# EAGLE design DualPower (EAGLE 9.6.2)
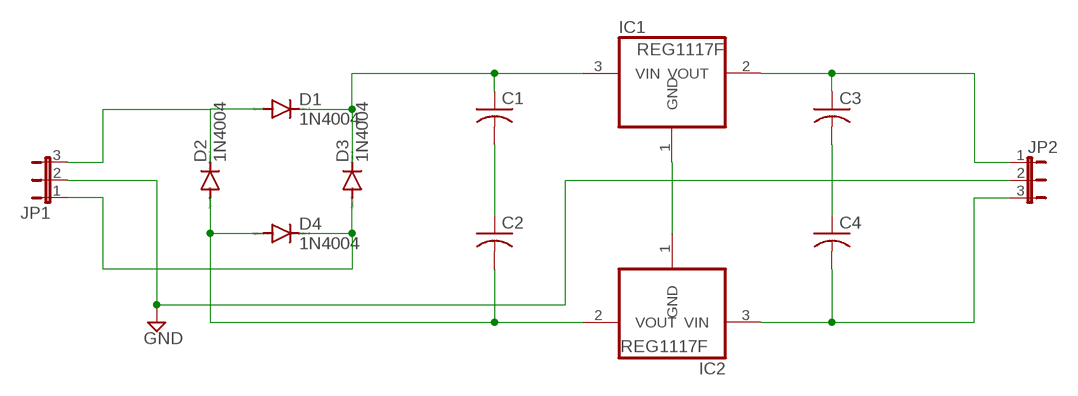
[diagram p0: schematic, sheet 1]

## Parts
C1  C-US025-040X050  [C025-040X050]
C2  C-US025-040X050  [C025-040X050]
C3  C-US025-040X050  [C025-040X050]
C4  C-US025-040X050  [C025-040X050]
D1  1N4004  [DO41-10]
D2  1N4004  [DO41-10]
D3  1N4004  [DO41-10]
D4  1N4004  [DO41-10]
IC1  REG1117F  [DD-3]
IC2  REG1117F  [DD-3]
JP1  JP2E  [JP2]
JP2  JP2E  [JP2]

## Nets
N$1: D1.A D2.C JP1.3
N$2: C2.2 D2.A D4.A IC2.2(VOUT)
N$3: D3.A D4.C JP1.1
N$4: C1.1 D1.C D3.C IC1.3(VIN)
N$5: C1.2 C2.1
N$6: IC1.1(GND) IC2.1(GND)
N$7: C3.2 C4.1
N$8: C3.1 IC1.2(VOUT) JP2.1
N$9: C4.2 IC2.3(VIN) JP2.3
N$11: JP1.2 JP2.2 ; supply symbol labelled GND

## Library data of the parts
C1-C4 = rcl:C-US: CAPACITOR, American symbol; SPICEPREFIX: C
D1-D4 = diode:1N4004: DIODE general purpose rectifier, 1 A
IC1 IC2 = burr-brown:REG1117: 800mA and 1A Low Dropout (LDO) Positive Regulator 1.8V, 2.5V, 2.85V, 3.3V, 5V, and Adj; MF: TEXAS INSTRUMENTS; MPN: REG1117FAKTTT; OC_FARNELL: 1296120; OC_NEWARK: 87H2562
JP1 JP2 = jumper:JP2E: JUMPER

## Board
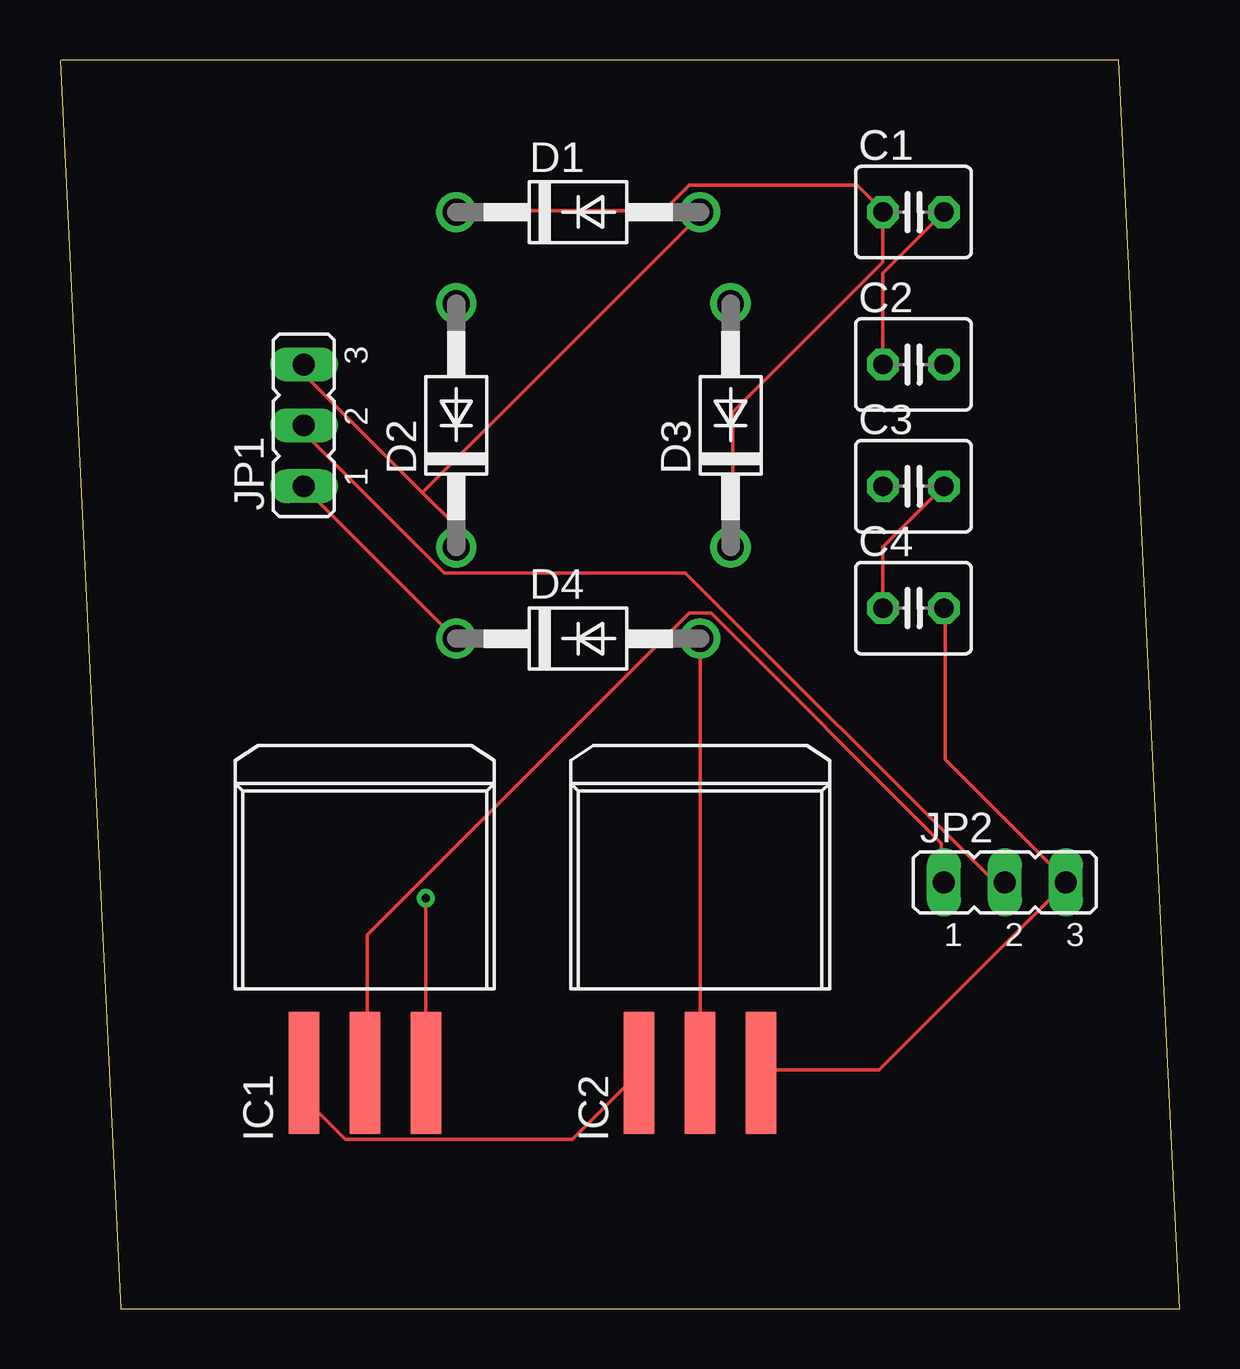
[diagram p1: board, top side]
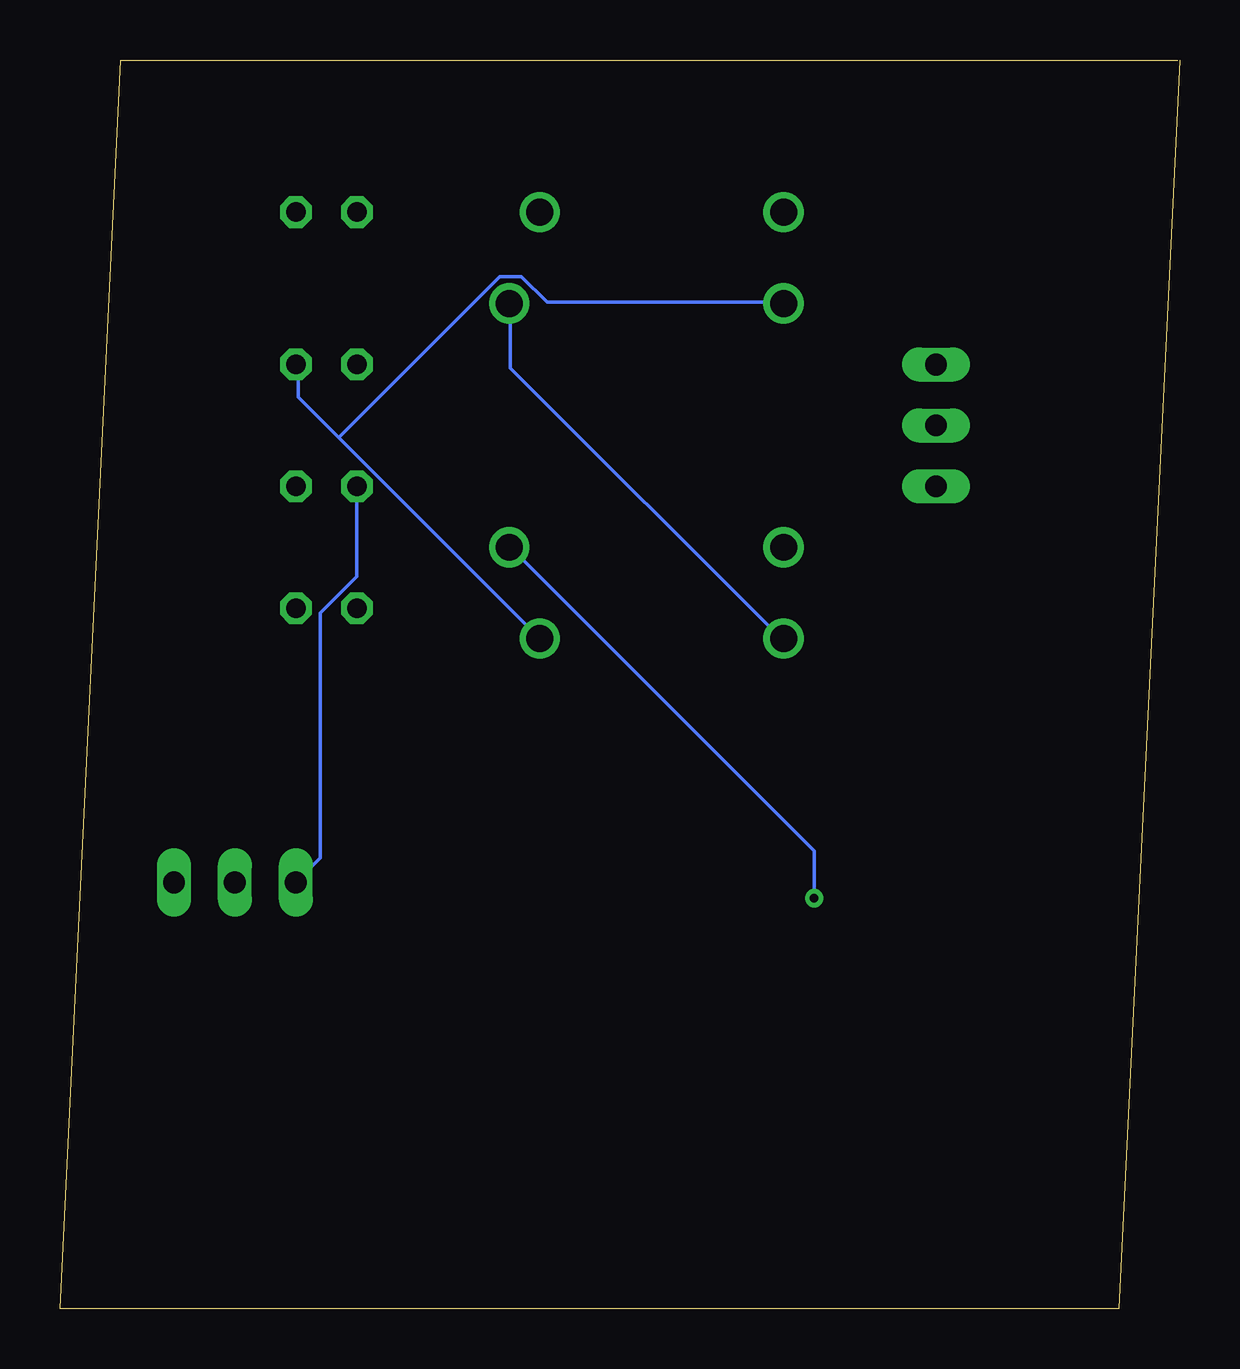
[diagram p2: board, bottom side, seen from below]

Size 46.66 x 52.06 mm. Coordinates in mm from the lower left corner, seen from the top.
Outline: 0,52.06 2.54,0 46.66,0 44.12,52.06 0.08,52.06
Copper layers (1*16): Top 0.035mm / dielectric 1.5mm / Bottom 0.035mm
Design rules "default": minimum track width 6mil, minimum drill 0.35mm, track to track 6mil, track to pad 6mil, pad to pad 6mil, via to via 6mil, smd to smd 6mil, copper to edge 40mil, drill to drill 6mil, minimum pad ring 10mil, minimum via ring 8mil, stop-mask expansion 4mil, vias tented up to drill 0mil, thermal gap 10mil

### Footprints (pad centres in the part's own frame; a part is rotated, then mirrored left to right if it is on the bottom)
C025-040X050 = drill 0.813 octagon: 1 -1.27,0; 2 1.27,0
DO41-10 = drill 1.118: A 5.08,0; C -5.08,0
DD-3 = smd 1.27 x 5.08: 1 -2.54,-7.938; 2 0,-7.938; 3 2.54,-7.938
JP2 = drill 0.914 long: 1 -2.54,0; 2 0,0; 3 2.54,0

### Placement (x,y rotation side)
C1  35.56,45.72 0 top
C2  35.56,39.37 0 top
C3  35.56,34.29 0 top
C4  35.56,29.21 0 top
D1  21.59,45.72 0 top
D2  16.51,36.83 90 top
D3  27.94,36.83 90 top
D4  21.59,27.94 0 top
IC1  12.7,17.78 0 top
IC2  26.67,17.78 0 top
JP1  10.16,36.83 90 top
JP2  39.37,17.78 0 top

### Tracks (layer width: path | path; a pad name or v marks a point on that pad's centre or on a via)
N$1
  Top 0.152: 15.09,34.04 16.46,32.66 16.46,31.75 D2.C | 15.09,34.04 10.21,38.91 10.21,39.37 JP1.3 | 15.09,34.04 26.67,45.62 D1.A
N$2
  Top 0.152: D4.A IC2.2
  Bottom 0.152: D4.A 35.05,36.32 | 35.05,36.32 36.73,38 36.73,39.37 C2.2 | 35.05,36.32 28.35,43.03 27.43,43.03 26.36,41.96 16.61,41.96 D2.A
N$3
  Top 0.152: JP1.1 10.21,34.19 16.46,27.94 D4.C
  Bottom 0.152: D3.A 27.89,41.81 27.89,39.22 16.61,27.94 D4.C
N$4  (via drill 0.35)
  Top 0.152: D3.C 28.04,31.75 28.04,37.39 34.29,43.64 C1.1 34.29,45.77 33.22,46.84 26.21,46.84 25.15,45.77 16.61,45.77 D1.C | v15.24,17.12 IC1.3
  Bottom 0.152: v15.24,17.12 15.24,19.1 27.89,31.75 D3.C
N$5
  Top 0.152: C2.1 34.29,43.18 C1.2
N$6
  Top 0.152: IC1.1 10.21,9.8 10.21,8.74 11.89,7.06 21.34,7.06 24.08,9.8 IC2.1
N$7
  Top 0.152: C4.1 34.29,31.75 C3.2
N$8
  Top 0.152: IC1.2 12.8,9.96 12.8,15.6 26.21,29.01 27.13,29.01 36.73,19.41 36.73,17.88 JP2.1
  Bottom 0.152: C3.1 34.29,30.53 35.81,29.01 35.81,18.8 JP2.1
N$9
  Top 0.152: C4.2 36.88,29.16 36.88,22.91 41.91,17.88 JP2.3 41.91,17.73 34.14,9.96 29.26,9.96 IC2.3
N$11
  Top 0.152: JP2.2 39.32,17.88 38.86,17.88 26.06,30.68 16,30.68 10.21,36.47 10.21,36.78 JP1.2